# Altium schematic sheet USB_OTG.SchDoc: USB_OTG_HS
size A4; DocumentNumber: MB1167; Revision: B.1; SheetNumber: 8; SheetTotal: 17; Project: STM327x6G-EVAL
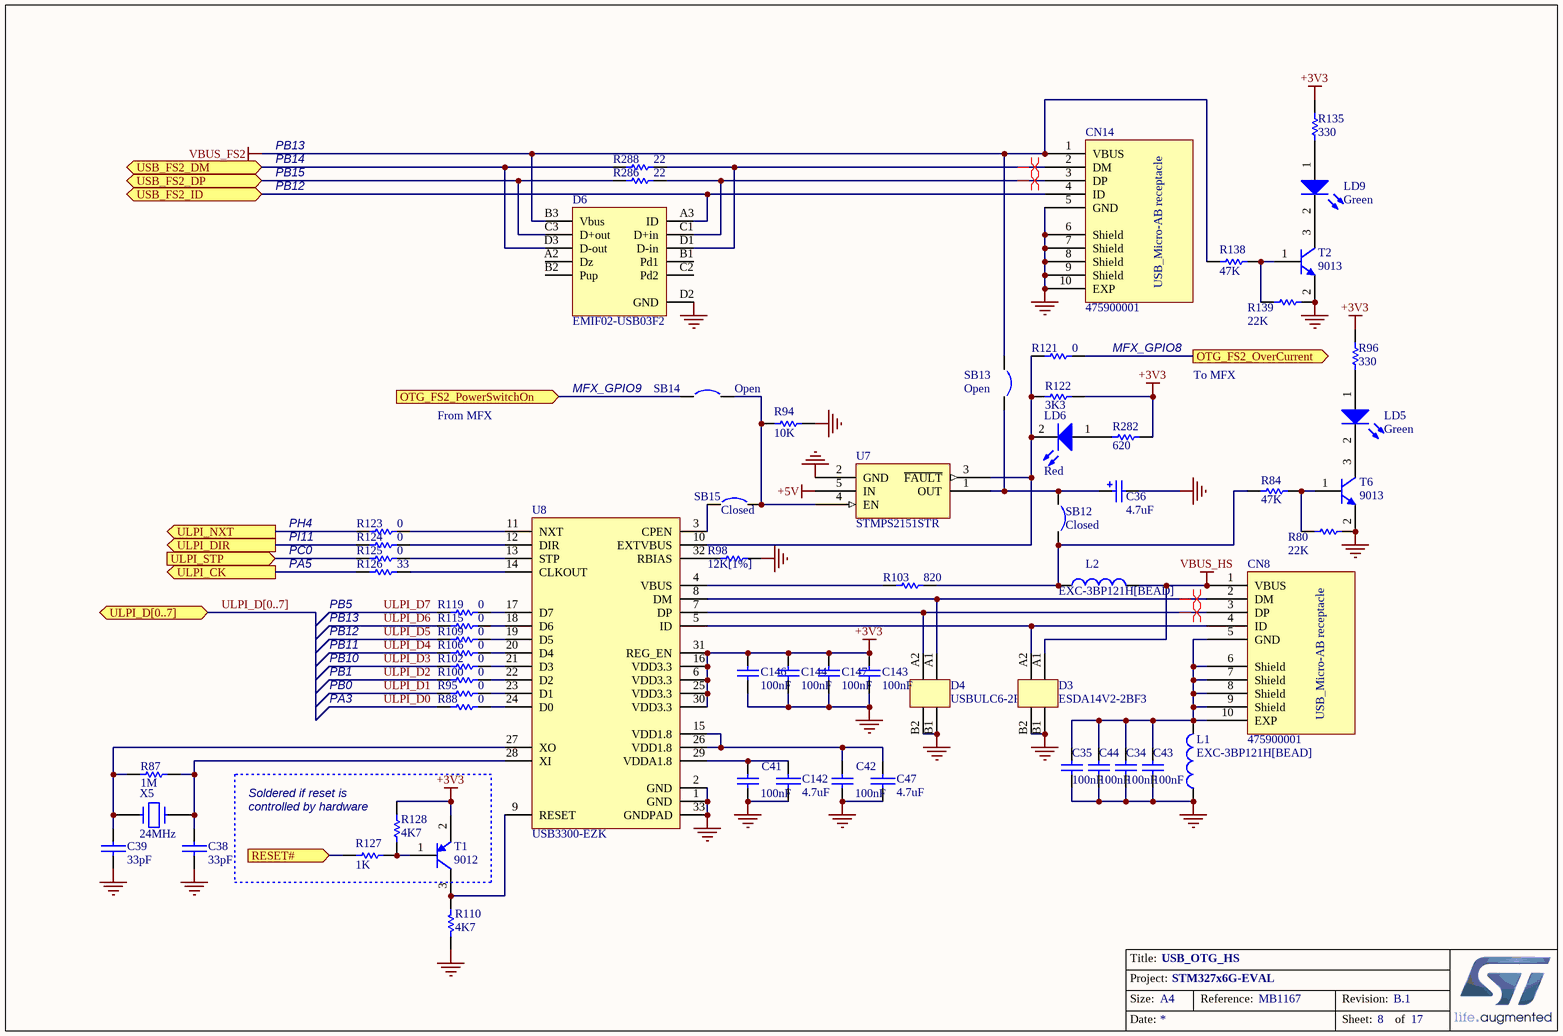
[diagram p0: USB_OTG.SchDoc]

## Parts
C34  100nF  [0603C]
C35  100nF  [0603C]
C36  4.7uF  [TAN-A]
C38  33pF  [0603C]
C39  33pF  [0603C]
C41  100nF  [0603C]
C42  100nF  [0603C]
C43  100nF  [0603C]
C44  100nF  [0603C]
C47  4.7uF  [TAN-A]
C142  4.7uF  [TAN-A]
C143  100nF  [0603C]
C144  100nF  [0603C]
C146  100nF  [0603C]
C147  100nF  [0603C]
CN8  475900001  [MOLEX_47590001]
CN14  475900001  [MOLEX_47590001]
D3  ESDA14V2-2BF3  [BGA4_0R4_0R8X0R8]
D4  USBULC6-2F3  [BGA4_0R4_1X1]
D6  EMIF02-USB03F2  [BGA11_0R5_1R57X2R07]
L1  EXC-3BP121H[BEAD]  [0603L]
L2  EXC-3BP121H[BEAD]  [0603L]
LD5  Green  [0603D]
LD6  Red  [0603D]
LD9  Green  [0603D]
R80  22K  [0603R]
R84  47K  [0603R]
R87  1M  [0603R]
R88  0  [0603R]
R94  10K  [0603R]
R95  0  [0603R]
R96  330  [0603R]
R98  12K[1%]  [0603R]
R100  0  [0603R]
R102  0  [0603R]
R103  820  [0603R]
R106  0  [0603R]
R109  0  [0603R]
R110  4K7  [0603R]
R115  0  [0603R]
R119  0  [0603R]
R121  0  [0603R]
R122  3K3  [0603R]
R123  0  [0603R]
R124  0  [0603R]
R125  0  [0603R]
R126  33  [0603R]
R127  1K  [0603R]
R128  4K7  [0603R]
R135  330  [0603R]
R138  47K  [0603R]
R139  22K  [0603R]
R282  620  [0603R]
R286  22  [0603R]
R288  22  [0603R]
SB12  Closed  [SB_0603]
SB13  Open  [SB_0603]
SB14  Open  [SB_0603]
SB15  Closed  [SB_0603]
T1  9012  [SOT-23]
T2  9013  [SOT-23]
T6  9013  [SOT-23]
U7  STMPS2151STR  [SOT23-5]
U8  USB3300-EZK  [QFN32_0R5_5X5]
X5  24MHz  [XTAL1]

## Ports
OTG_FS2_OverCurrent (out), OTG_FS2_PowerSwitchOn (in), RESET# (in), ULPI_CK (out), ULPI_D[0..7] (bidir), ULPI_DIR (out), ULPI_NXT (out), ULPI_STP (in), USB_FS2_DM (bidir), USB_FS2_DP (bidir), USB_FS2_ID (bidir)

## Nets
+3V3: C143.1 C144.1 C146.1 C147.1 R96.2 R122.1 R128.1 R135.2 R282.2 T1.2(E) U8.6(VDD3.3) U8.16(VDD3.3) U8.25(VDD3.3) U8.30(VDD3.3) U8.31(REG_EN)
+5V: U7.5(IN)
GND: C34.2 C35.2 C36.2 C38.2 C39.2 C41.2 C42.2 C43.2 C44.2 C47.2 C142.2 C143.2 C144.2 C146.2 C147.2 CN14.5(GND) CN14.6(Shield) CN14.7(Shield) CN14.8(Shield) CN14.9(Shield) CN14.10(EXP) D3.B1 D3.B2 D4.B1 D4.B2 D6.D2(GND) L1.1 R80.1 R94.1 R98.1 R110.1 R139.1 T2.2(E) T6.2(E) U7.2(GND) U8.1(GND) U8.2(GND) U8.33(GNDPAD)
VBUS_FS2: CN14.1(VBUS) D6.B3(Vbus) R138.1 SB13.1
VBUS_HS: CN8.1(VBUS) D3.A1 L2.2
OTG_FS2_OverCurrent: R121.1 ; port OTG_FS2_OverCurrent
OTG_FS2_PowerSwitchOn: SB14.1 ; port OTG_FS2_PowerSwitchOn
RESET#: R127.2 ; port RESET#
ULPI_CK: R126.2 ; port ULPI_CK
ULPI_D0: R88.2
ULPI_D1: R95.2
ULPI_D2: R100.2
ULPI_D3: R102.2
ULPI_D4: R106.2
ULPI_D5: R109.2
ULPI_D6: R115.2
ULPI_D7: R119.2
ULPI_DIR: R124.2 ; port ULPI_DIR
ULPI_NXT: R123.2 ; port ULPI_NXT
ULPI_STP: R125.2 ; port ULPI_STP
USB_FS2_DM: D6.D3(D-out) R288.2 ; port USB_FS2_DM
USB_FS2_DP: D6.C3(D+out) R286.2 ; port USB_FS2_DP
USB_FS2_ID: CN14.4(ID) D6.A3(ID) ; port USB_FS2_ID
NetC34_1: C34.1 C35.1 C43.1 C44.1 CN8.5(GND) CN8.6(Shield) CN8.7(Shield) CN8.8(Shield) CN8.9(Shield) CN8.10(EXP) L1.2
NetC36_1: C36.1 SB12.1 SB13.2 U7.1(OUT)
NetC38_1: C38.1 R87.2 U8.28(XI) X5.1
NetC39_1: C39.1 R87.1 U8.27(XO) X5.2
NetC41_1: C41.1 C142.1 U8.29(VDDA1.8)
NetC42_1: C42.1 C47.1 U8.15(VDD1.8) U8.26(VDD1.8)
NetCN8_2: CN8.2(DM) D4.A1 U8.8(DM)
NetCN8_3: CN8.3(DP) D4.A2 U8.7(DP)
NetCN8_4: CN8.4(ID) D3.A2 U8.5(ID)
NetCN14_2: CN14.2(DM) D6.D1(D-in) R288.1
NetCN14_3: CN14.3(DP) D6.C1(D+in) R286.1
NetL2_1: L2.1 R84.2 R103.2 SB12.2
NetLD5_1: LD5.1(A) R96.1
NetLD5_2: LD5.2(K) T6.3(C)
NetLD6_1: LD6.1(A) R282.1
NetLD6_2: LD6.2(K) R121.2 R122.2 U7.3(~{FAULT}) U8.10(EXTVBUS)
NetLD9_1: LD9.1(A) R135.1
NetLD9_2: LD9.2(K) T2.3(C)
NetR80_2: R80.2 R84.1 T6.1(B)
NetR88_1: R88.1 U8.24(D0)
NetR94_2: R94.2 SB14.2 SB15.2 U7.4(EN)
NetR95_1: R95.1 U8.23(D1)
NetR98_2: R98.2 U8.32(RBIAS)
NetR100_1: R100.1 U8.22(D2)
NetR102_1: R102.1 U8.21(D3)
NetR103_1: R103.1 U8.4(VBUS)
NetR106_1: R106.1 U8.20(D4)
NetR109_1: R109.1 U8.19(D5)
NetR110_2: R110.2 T1.3(C) U8.9(RESET)
NetR115_1: R115.1 U8.18(D6)
NetR119_1: R119.1 U8.17(D7)
NetR123_1: R123.1 U8.11(NXT)
NetR124_1: R124.1 U8.12(DIR)
NetR125_1: R125.1 U8.13(STP)
NetR126_1: R126.1 U8.14(CLKOUT)
NetR127_1: R127.1 R128.2 T1.1(B)
NetR138_2: R138.2 R139.2 T2.1(B)
NetSB15_1: SB15.1 U8.3(CPEN)

Not connected (* = marked no-connect by the designer): D6 A2(Dz) B1(Pd1) B2(Pup) C2(Pd2)

## Buses and harness runs
bus ULPI_D[0..7] = port ULPI_D[0..7]

## Layout directives
differential pair: NetCN8_2, NetCN8_3, NetCN14_2, NetCN14_3

## Notes on the sheet
- PB13
- PB14
- PB15
- PB12
- MFX_GPIO8
- To MFX
- From MFX
- MFX_GPIO9
- PH4
- PI11
- PC0
- PA5
- PB11
- PB5
- PA3
- PB0
- PB1
- PB10
- (near R128) Soldered if reset is
- (near R128) controlled by hardware
- Title:
- Project:
- Size:
- Date:
- A4
- Reference:
- Sheet:
- Revision:
- of
- (in symbol 475900001) USB_Micro-AB receptacle

## Library data of the parts
C34 C35 C41-C44 C143 C144 C146 C147 = Cap: Capacitor; Value: 10nF; Published: 8-Jun-2000; Revision: July-2002: Re-released for DXP Platform.; Publisher: Altium Limited
C36 = Cap Pol1: Polarized Capacitor (Radial); Value: 47uF; Published: 8-Jun-2000; Revision: July-2002: Re-released for DXP Platform.; Publisher: Altium Limited
C38 C39 C47 C142 = CAP: Capacitor
L1 L2 = Inductor: Value: 100uH; Published: 8-Jun-2000; Revision: July-2002: Re-released for DXP Platform.; Publisher: Altium Limited
LD5 LD6 LD9 = LED2: Typical RED, GREEN, YELLOW, AMBER GaAs LED; Published: 8-Jun-2000; Revision: July-2002: Re-released for DXP Platform.; Publisher: Altium Limited
R80 R84 R94 R96 R103 R122 R135 R138 R139 = res1: Resistor; Value: 1K; Published: 8-Jun-2000; Revision: July-2002: Re-released for DXP Platform.; Publisher: Altium Limited
R87 R88 R95 R98 R100 R102 R106 R109 R110 R115 R119 R121 R123-R126 R128 R282 R286 R288 = Res1: Resistor; Value: 1K; Published: 8-Jun-2000; Revision: July-2002: Re-released for DXP Platform.; Publisher: Altium Limited
R127 = Res1: Resistor; Published: 8-Jun-2000; Revision: July-2002: Re-released for DXP Platform.; Publisher: Altium Limited; Value: 1K
SB12 SB15 = Circuit Breaker_close: Circuit Breaker; Published: 24-Mar-1999; Revision: July-2002: Re-released for DXP Platform.; Publisher: Altium Limited
SB13 SB14 = Circuit Breaker: Published: 24-Mar-1999; Revision: July-2002: Re-released for DXP Platform.; Publisher: Altium Limited
T1 = PNP: PNP Bipolar Transistor; Published: 8-Jun-2000; Revision: July-2002: Re-released for DXP Platform.; Publisher: Altium Limited; Code - JEDEC: SOT-23
T2 T6 = NPN: NPN Bipolar Transistor; Code - JEDEC: TO-226-AA; Published: 8-Jun-2000; Revision: July-2002: Re-released for DXP Platform.; Publisher: Altium Limited
U7 = STMPS2141STR
X5 = CRYSTAL